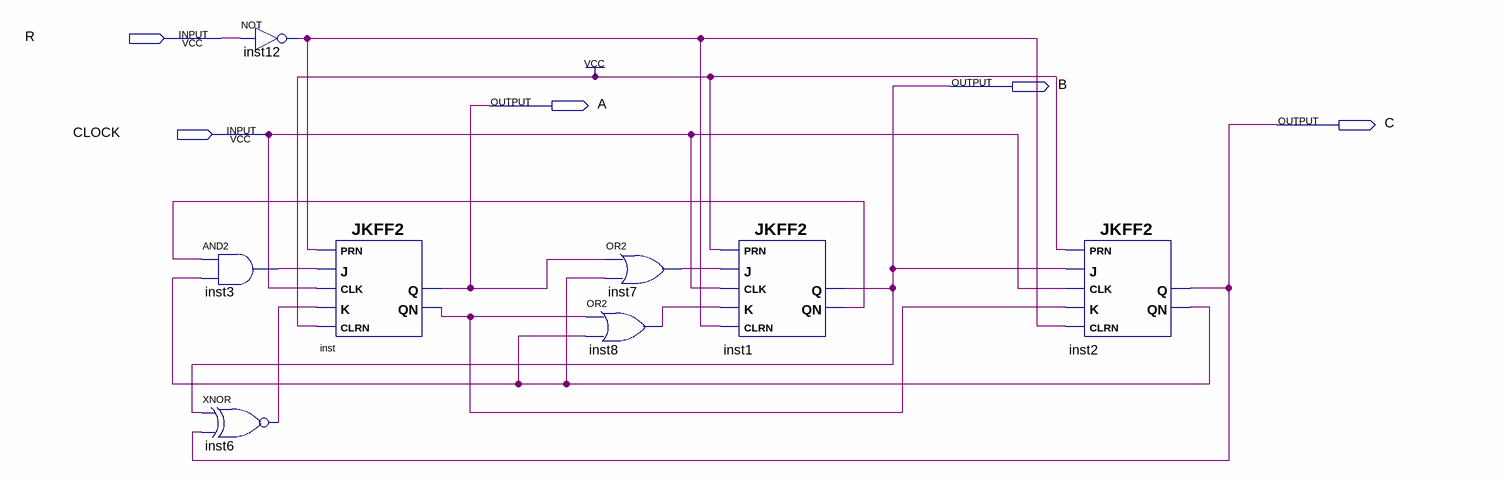
[diagram p0: schematic sheet]
// Quartus schematic ex2-lista4.bdf as structural Verilog: 8 symbols, 5 pins
module \ex2-lista4  (
  input  R,
  input  CLOCK,
  output B,
  output A,
  output C
);

  wire inst1_qn, inst2_qn, inst3_out, inst6_out, inst7_out, inst8_out, inst12_out, inst_qn;

  not inst12 (inst12_out, R);
  and inst3 (inst3_out, inst1_qn, inst2_qn);
  xnor inst6 (inst6_out, B, C);
  JKFF2 inst (.K(inst6_out), .CLRN(1'b1), .CLK(CLOCK), .PRN(inst12_out), .J(inst3_out), .QN(inst_qn), .Q(A));
  or inst7 (inst7_out, A, inst2_qn);
  or inst8 (inst8_out, inst_qn, inst2_qn);
  JKFF2 inst1 (.K(inst8_out), .CLRN(inst12_out), .CLK(CLOCK), .PRN(1'b1), .J(inst7_out), .QN(inst1_qn), .Q(B));
  JKFF2 inst2 (.K(inst_qn), .CLRN(inst12_out), .CLK(CLOCK), .PRN(1'b1), .J(B), .QN(inst2_qn), .Q(C));
endmodule
